# EAGLE design led_demo-v2 (EAGLE 7.1.0)
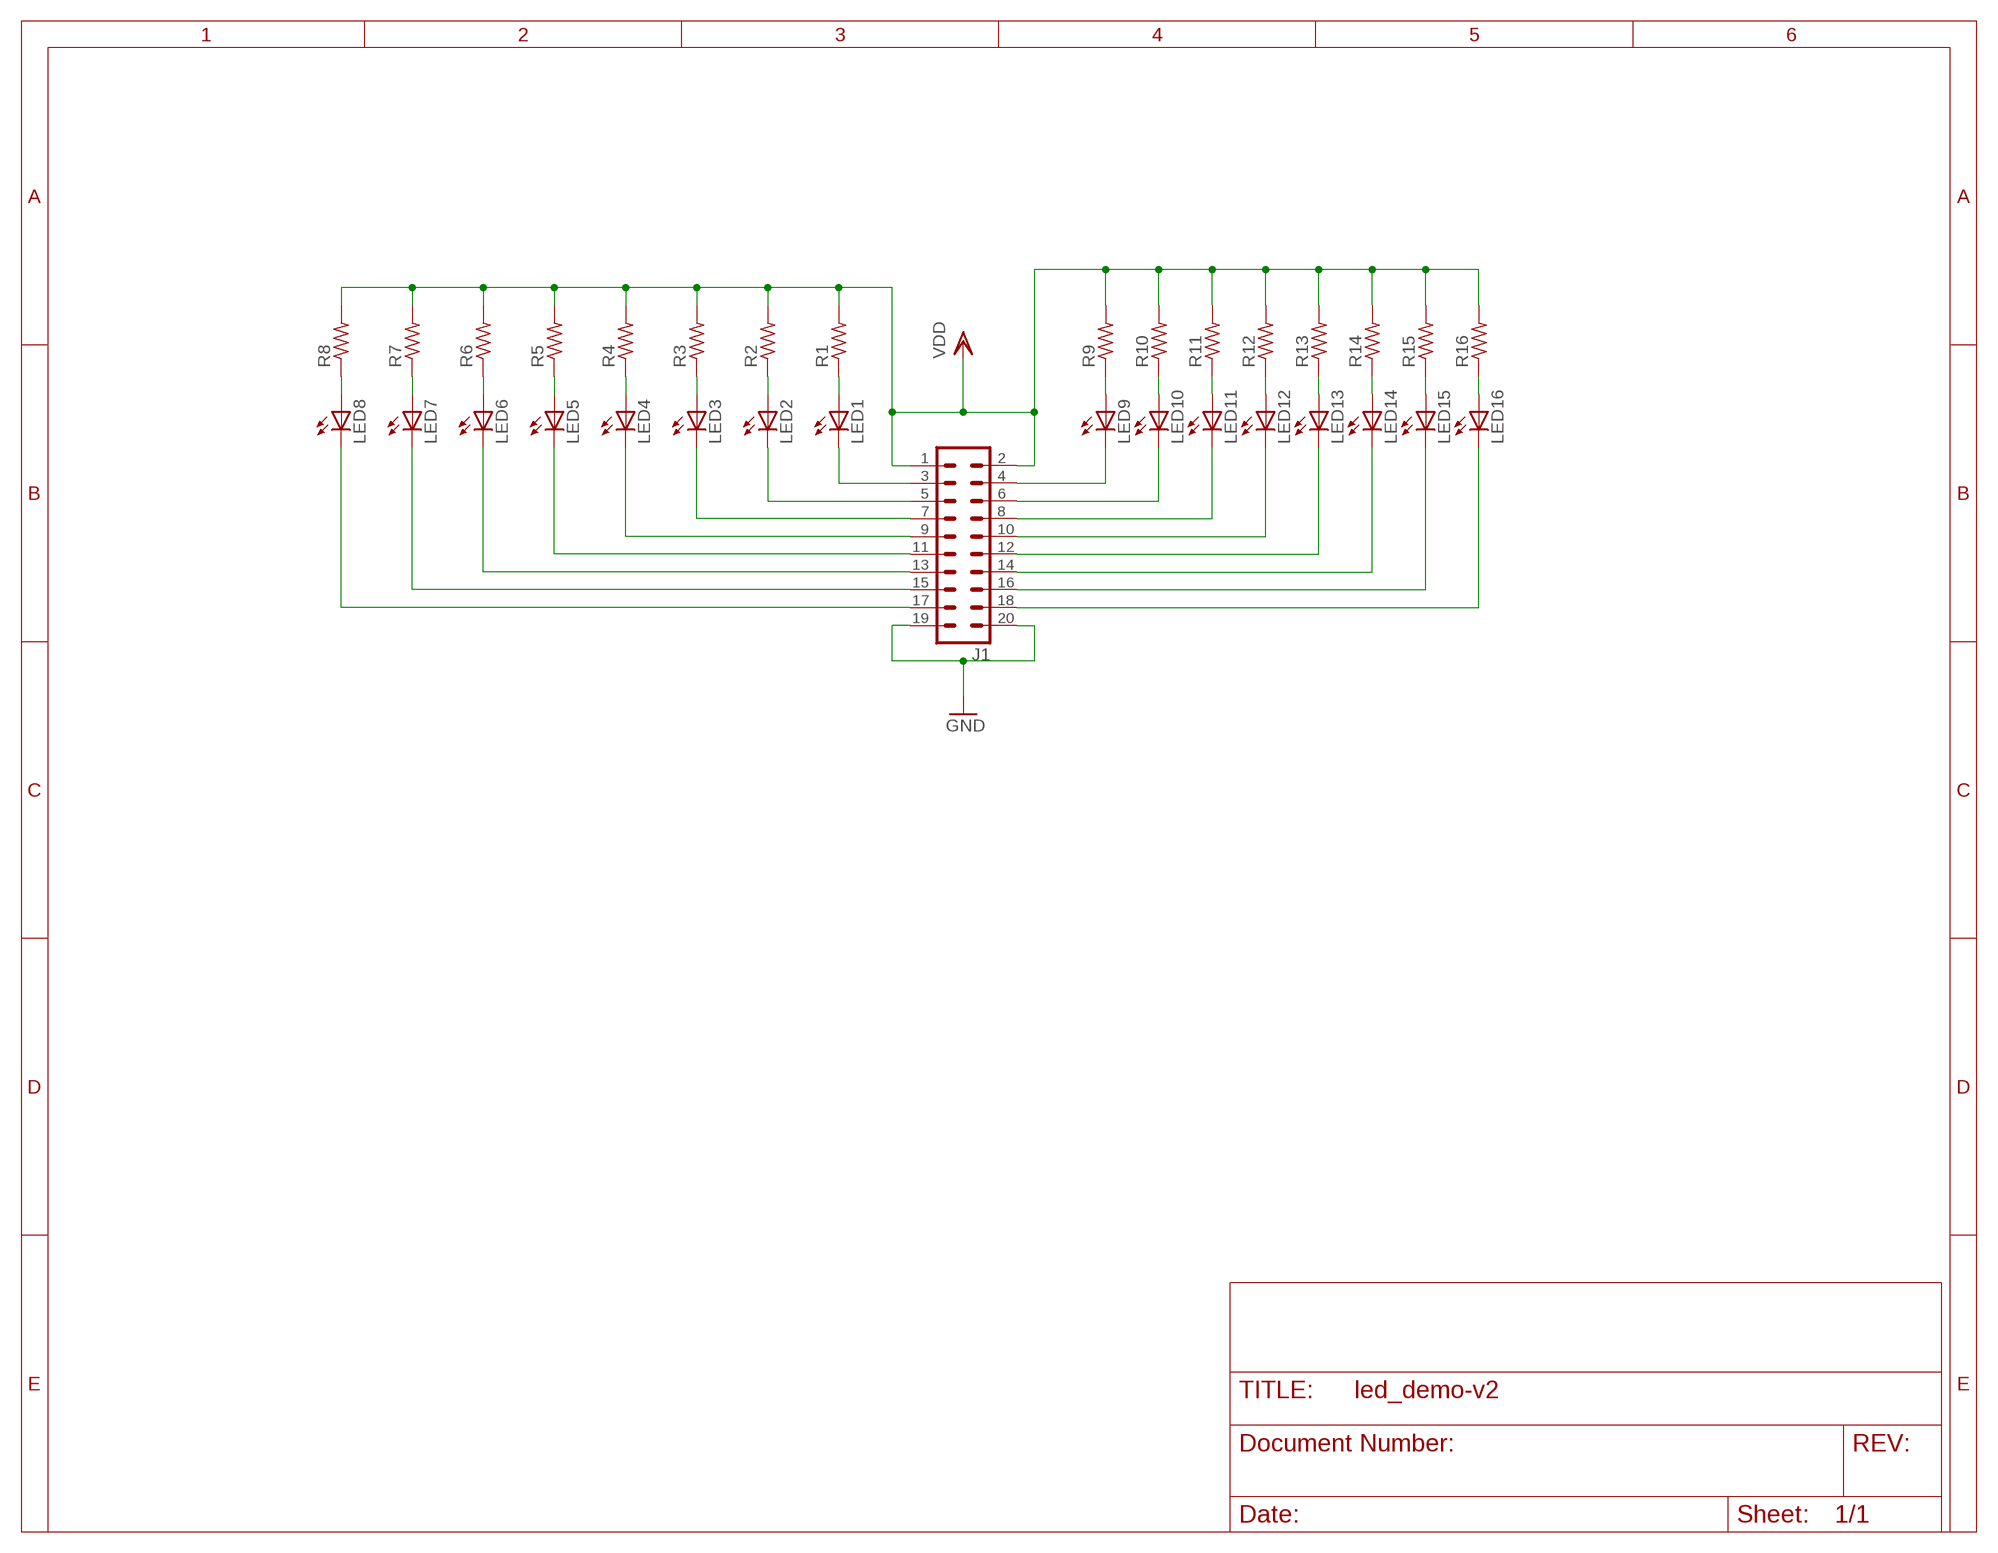
[diagram p0: schematic, sheet 1]

## Parts
J1  MA10-2  [MA10-2]
LED1  LED3MM  [LED3MM]
LED2  LED3MM  [LED3MM]
LED3  LED3MM  [LED3MM]
LED4  LED3MM  [LED3MM]
LED5  LED3MM  [LED3MM]
LED6  LED3MM  [LED3MM]
LED7  LED3MM  [LED3MM]
LED8  LED3MM  [LED3MM]
LED9  LED3MM  [LED3MM]
LED10  LED3MM  [LED3MM]
LED11  LED3MM  [LED3MM]
LED12  LED3MM  [LED3MM]
LED13  LED3MM  [LED3MM]
LED14  LED3MM  [LED3MM]
LED15  LED3MM  [LED3MM]
LED16  LED3MM  [LED3MM]
R1  R-US_0204/2V  [0204V]
R2  R-US_0204/2V  [0204V]
R3  R-US_0204/2V  [0204V]
R4  R-US_0204/2V  [0204V]
R5  R-US_0204/2V  [0204V]
R6  R-US_0204/2V  [0204V]
R7  R-US_0204/2V  [0204V]
R8  R-US_0204/2V  [0204V]
R9  R-US_0204/2V  [0204V]
R10  R-US_0204/2V  [0204V]
R11  R-US_0204/2V  [0204V]
R12  R-US_0204/2V  [0204V]
R13  R-US_0204/2V  [0204V]
R14  R-US_0204/2V  [0204V]
R15  R-US_0204/2V  [0204V]
R16  R-US_0204/2V  [0204V]

## Nets
GND: J1.19 J1.20
N$1: LED8.A R8.1
N$2: LED7.A R7.1
N$3: LED6.A R6.1
N$4: LED5.A R5.1
N$5: LED4.A R4.1
N$6: LED3.A R3.1
N$7: LED2.A R2.1
N$8: LED1.A R1.1
N$9: J1.3 LED1.K(C)
N$10: J1.5 LED2.K(C)
N$11: J1.7 LED3.K(C)
N$12: J1.9 LED4.K(C)
N$13: J1.11 LED5.K(C)
N$14: J1.13 LED6.K(C)
N$15: J1.15 LED7.K(C)
N$16: J1.17 LED8.K(C)
N$17: J1.4 LED9.K(C)
N$18: J1.6 LED10.K(C)
N$19: J1.8 LED11.K(C)
N$20: J1.10 LED12.K(C)
N$21: J1.12 LED13.K(C)
N$22: J1.14 LED14.K(C)
N$23: J1.16 LED15.K(C)
N$24: J1.18 LED16.K(C)
N$25: LED16.A R16.1
N$26: LED15.A R15.1
N$27: LED14.A R14.1
N$28: LED13.A R13.1
N$29: LED12.A R12.1
N$30: LED11.A R11.1
N$31: LED10.A R10.1
N$32: LED9.A R9.1
VDD: J1.1 J1.2 R1.2 R2.2 R3.2 R4.2 R5.2 R6.2 R7.2 R8.2 R9.2 R10.2 R11.2 R12.2 R13.2 R14.2 R15.2 R16.2

## Library data of the parts
J1 = MA_HEADER:MA10-2: PIN HEADER; OC_FARNELL: unknown; OC_NEWARK: unknown
LED1-LED16 = adafruit:LED: LED OSRAM: - CHIPLED LG R971, LG N971, LY N971, LG Q971, LY Q971, LO R971, LY R971 LH N974, LH R974 LS Q976, LO Q976, LY Q976 LO Q996 - Hyper CHIPLED LW Q18S LB Q993, LB Q99A, LB R99A - SideLED LS A670, LO A670, LY A670, LG A670, LP A670 LB A673, LV A673, LT A673, LW A673 LH A674 LY A675 LS A676, LA A676, LO A676, LY A676, LW A676 LS A679, LY A679, LG A679 - Hyper Micro SIDELED® LS Y876, LA Y876, LO Y876, LY Y876 LT Y87S - SmartLED LW L88C, LW L88S LB L89C, LB L89S, LG L890 LS L89K, LO L89K, LY L89K LS L896, LA L896, LO L896, LY L896 - TOPLED LS T670, LO T670, LY T670, LG T670, LP T670 LSG T670, LSP T670, LSY T670, LOP T670, LYG T670 LG T671, LOG T671, LSG T671 LB T673, LV T673, LT T673, LW T673 LH T674 LS T676, LA T676, LO T676, LY T676, LB T676, LH T676, LSB T676, LW T676 LB T67C, LV T67C, LT T67C, LS T67K, LO T67K, LY T67K, LW E67C LS E67B, LA E67B, LO E67B, LY E67B, LB E67C, LV E67C, LT E67C LW T67C LS T679, LY T679, LG T679 LS T770, LO T770, LY T770, LG T770, LP T770 LB T773, LV T773, LT T773, LW T773 LH T774 LS E675, LA E675, LY E675, LS T675 LS T776, LA T776, LO T776, LY T776, LB T776 LHGB T686 LT T68C, LB T68C - Hyper Mini TOPLED® LB M676 - Mini TOPLED Santana® LG M470 LS M47K, LO M47K, LY M47K Source: http://www.osram.convergy.de/
R1-R16 = adafruit:R-US_: RESISTOR, American symbol

## Board
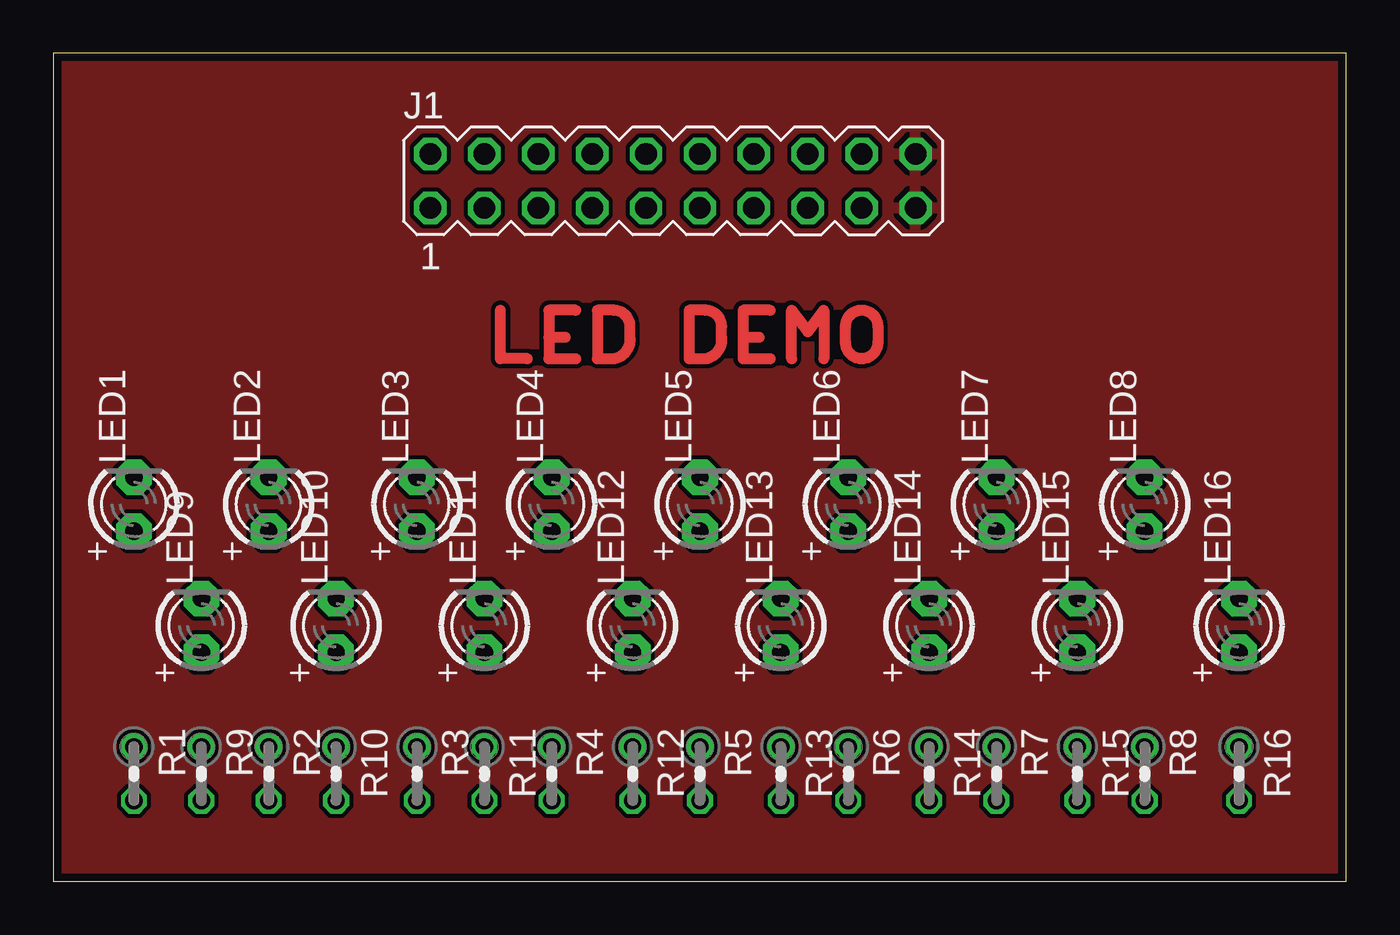
[diagram p1: board, top side]
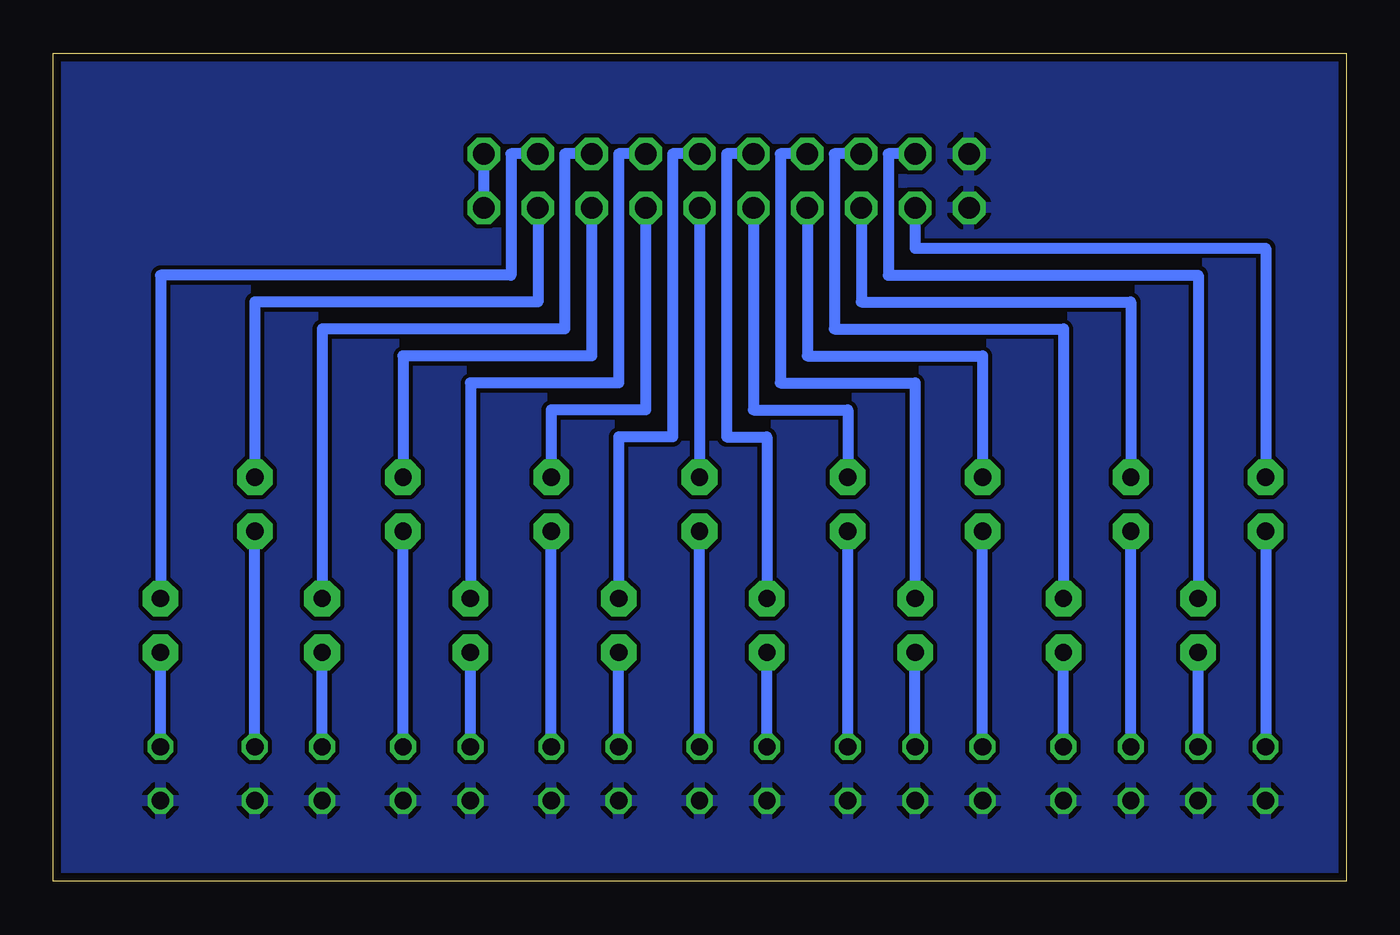
[diagram p2: board, bottom side, seen from below]

Size 60.94 x 39.04 mm. Coordinates in mm from the lower left corner, seen from the top.
Outline: 0,0 60.94,0 60.94,39.04 0,39.04 0,0
Copper layers (1*16): Top 0.0178mm / dielectric 59mil / Bottom 0.0178mm
Design rules "epl-lpkf": minimum track width 8mil, minimum drill 0.35mm, track to track 8mil, track to pad 8mil, pad to pad 8mil, via to via 8mil, smd to smd 8mil, copper to edge 15mil, drill to drill 15mil, minimum pad ring 8mil, minimum via ring 8mil, stop-mask expansion 3mil, vias tented up to drill 0mil, thermal gap 10mil

### Footprints (pad centres in the part's own frame; a part is rotated, then mirrored left to right if it is on the bottom)
MA10-2 = drill 1.016 octagon: 1 -11.43,-1.27; 2 -11.43,1.27; 3 -8.89,-1.27; 4 -8.89,1.27; 5 -6.35,-1.27; 6 -6.35,1.27; 7 -3.81,-1.27; 8 -3.81,1.27; 9 -1.27,-1.27; 10 -1.27,1.27; 11 1.27,-1.27; 12 1.27,1.27; 13 3.81,-1.27; 14 3.81,1.27; 15 6.35,-1.27; 16 6.35,1.27; 17 8.89,-1.27; 18 8.89,1.27; 19 11.43,-1.27; 20 11.43,1.27
LED3MM = drill 0.813 pad 1.676 octagon: A -1.27,0; K 1.27,0
0204V = drill 0.813 octagon: 1 -1.27,0; 2 1.27,0

### Placement (x,y rotation side)
J1  29.21,33.02 0 top
LED1  3.81,17.78 90 top
LED2  10.16,17.78 90 top
LED3  17.14,17.78 90 top
LED4  23.5,17.78 90 top
LED5  30.48,17.78 90 top
LED6  37.47,17.78 90 top
LED7  44.45,17.78 90 top
LED8  51.44,17.78 90 top
LED9  6.99,12.06 90 top
LED10  13.34,12.06 90 top
LED11  20.32,12.06 90 top
LED12  27.3,12.06 90 top
LED13  34.29,12.06 90 top
LED14  41.27,12.06 90 top
LED15  48.26,12.06 90 top
LED16  55.88,12.06 90 top
R1  3.81,5.08 270 top
R2  10.16,5.08 270 top
R3  17.14,5.08 270 top
R4  23.5,5.08 270 top
R5  30.48,5.08 270 top
R6  37.47,5.08 270 top
R7  44.45,5.08 270 top
R8  51.44,5.08 270 top
R9  6.99,5.08 270 top
R10  13.34,5.08 270 top
R11  20.32,5.08 270 top
R12  27.3,5.08 270 top
R13  34.29,5.08 270 top
R14  41.27,5.08 270 top
R15  48.26,5.08 270 top
R16  55.88,5.08 270 top

### Tracks (layer width: path | path; a pad name or v marks a point on that pad's centre or on a via)
GND
  Bottom 0.508: J1.19 J1.20
  pour Top: 60.96,0 0,0 0,39.37 60.96,39.37
N$1
  Bottom 0.508: R8.1 LED8.A
N$2
  Bottom 0.508: R7.1 LED7.A
N$3
  Bottom 0.508: R6.1 LED6.A
N$4
  Bottom 0.508: R5.1 LED5.A
N$5
  Bottom 0.508: R4.1 LED4.A
N$6
  Bottom 0.508: R3.1 LED3.A
N$7
  Bottom 0.508: R2.1 LED2.A
N$8
  Bottom 0.508: LED1.A R1.1
N$9
  Bottom 0.508: J1.3 20.32,29.84 3.81,29.84 LED1.K
N$10
  Bottom 0.508: J1.5 22.86,27.3 10.16,27.3 LED2.K
N$11
  Bottom 0.508: J1.7 25.4,24.77 17.14,24.77 LED3.K
N$12
  Bottom 0.508: J1.9 27.94,22.23 23.5,22.23 LED4.K
N$13
  Bottom 0.508: J1.11 LED5.K
N$14
  Bottom 0.508: J1.13 33.02,22.23 37.47,22.23 LED6.K
N$15
  Bottom 0.508: J1.15 35.56,24.77 44.45,24.77 LED7.K
N$16
  Bottom 0.508: J1.17 38.1,27.3 51.44,27.3 LED8.K
N$17
  Bottom 0.508: J1.4 21.59,34.29 21.59,28.57 6.99,28.57 LED9.K
N$18
  Bottom 0.508: J1.6 24.13,34.29 24.13,26.04 13.34,26.04 LED10.K
N$19
  Bottom 0.508: J1.8 26.67,34.29 26.67,23.5 20.32,23.5 LED11.K
N$20
  Bottom 0.508: J1.10 29.21,34.29 29.21,20.95 27.3,20.95 LED12.K
N$21
  Bottom 0.508: J1.12 31.75,34.29 31.75,20.95 34.29,20.95 LED13.K
N$22
  Bottom 0.508: J1.14 34.29,34.29 34.29,23.5 41.27,23.5 LED14.K
N$23
  Bottom 0.508: J1.16 36.83,34.29 36.83,26.04 48.26,26.04 LED15.K
N$24
  Bottom 0.508: J1.18 39.37,34.29 39.37,28.57 55.88,28.57 LED16.K
N$25
  Bottom 0.508: R16.1 LED16.A
N$26
  Bottom 0.508: R15.1 LED15.A
N$27
  Bottom 0.508: R14.1 LED14.A
N$28
  Bottom 0.508: R13.1 LED13.A
N$29
  Bottom 0.508: R12.1 LED12.A
N$30
  Bottom 0.508: R11.1 LED11.A
N$31
  Bottom 0.508: R10.1 LED10.A
N$32
  Bottom 0.508: R9.1 LED9.A
N$33
  Top 0.508: 24.64,26.92 23.37,26.92 23.37,25.65 | 23.37,25.65 23.37,24.64 24.64,24.64 | 23.37,25.65 24.13,25.65
N$34
  Top 0.508: 25.65,26.92 25.65,24.64 26.42,24.64 arc90 27.18,25.65 27.18,26.16 arc90 26.42,26.92 25.65,26.92
N$35
  Top 0.508: 22.35,24.64 21.08,24.64 21.08,26.92
N$36
  Top 0.508: 29.97,26.92 29.97,24.64 30.73,24.64 arc90 31.5,25.65 31.5,26.16 arc90 30.73,26.92 29.97,26.92
N$37
  Top 0.508: 33.78,26.92 32.51,26.92 32.51,25.65 | 32.51,25.65 32.51,24.64 33.78,24.64 | 32.51,25.65 33.27,25.65
N$38
  Top 0.508: 34.8,24.64 34.8,26.92 35.56,25.91 36.32,26.92 36.32,24.64
N$39
  Top 0.508: 38.1,24.64 arc-90 37.34,25.4 37.34,26.16 arc-90 38.1,26.92 arc-90 38.86,26.16 38.86,25.4 arc-90 38.1,24.64
VDD
  pour Bottom: 60.96,0 0,0 0,39.37 60.96,39.37